# Altium project Eink_Smartwatch.PrjPcb
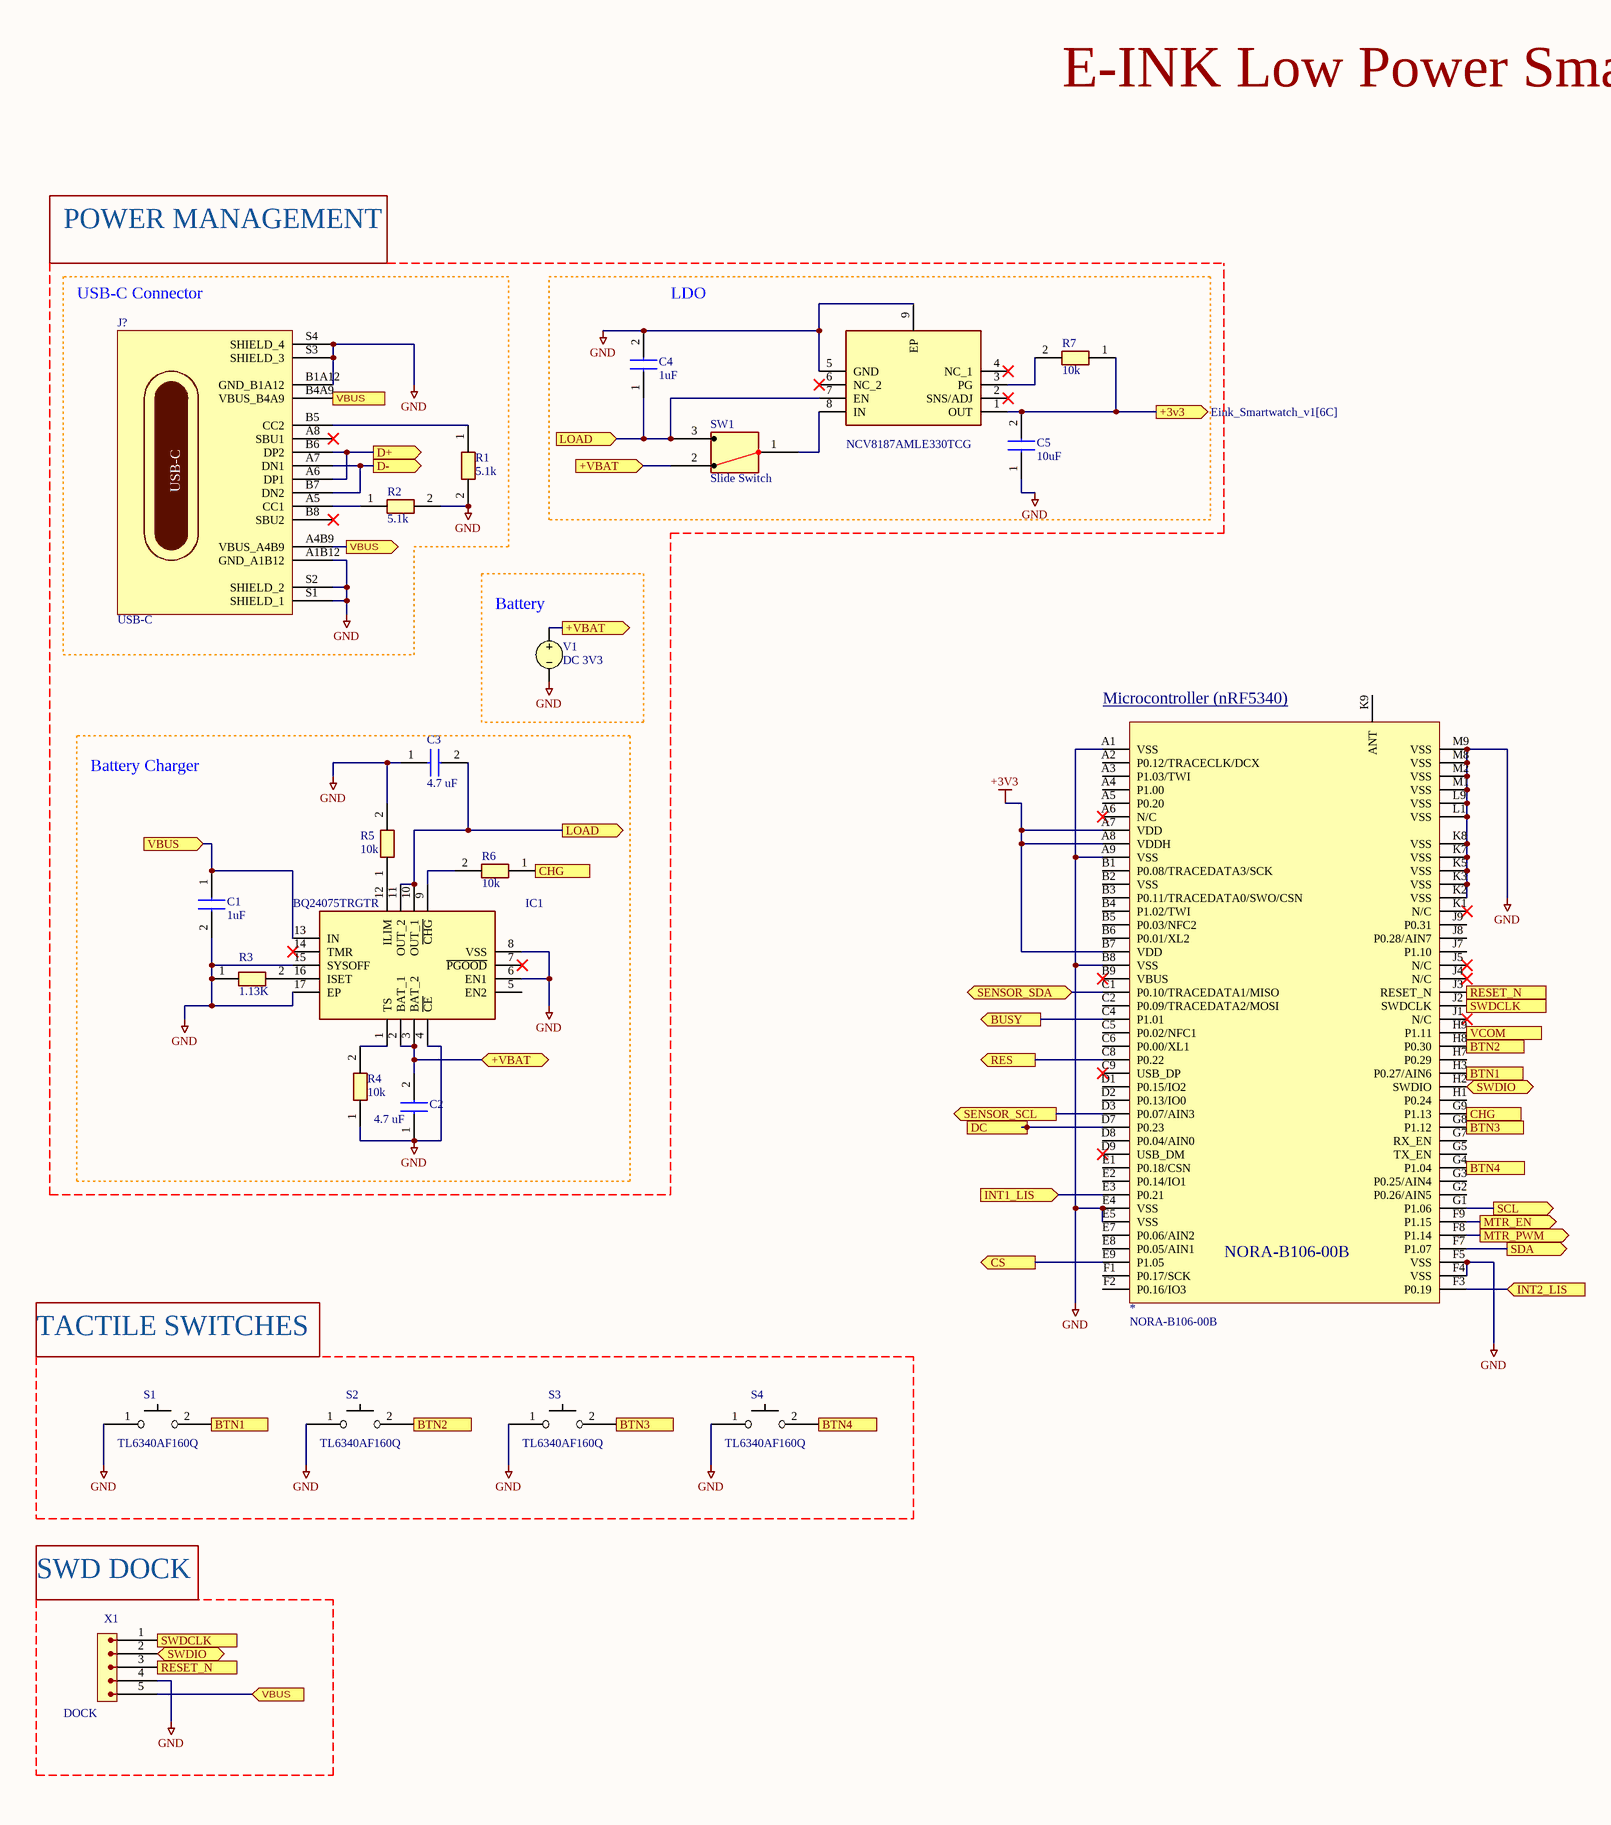
[diagram p0: Eink_Smartwatch_v1.SchDoc, left]
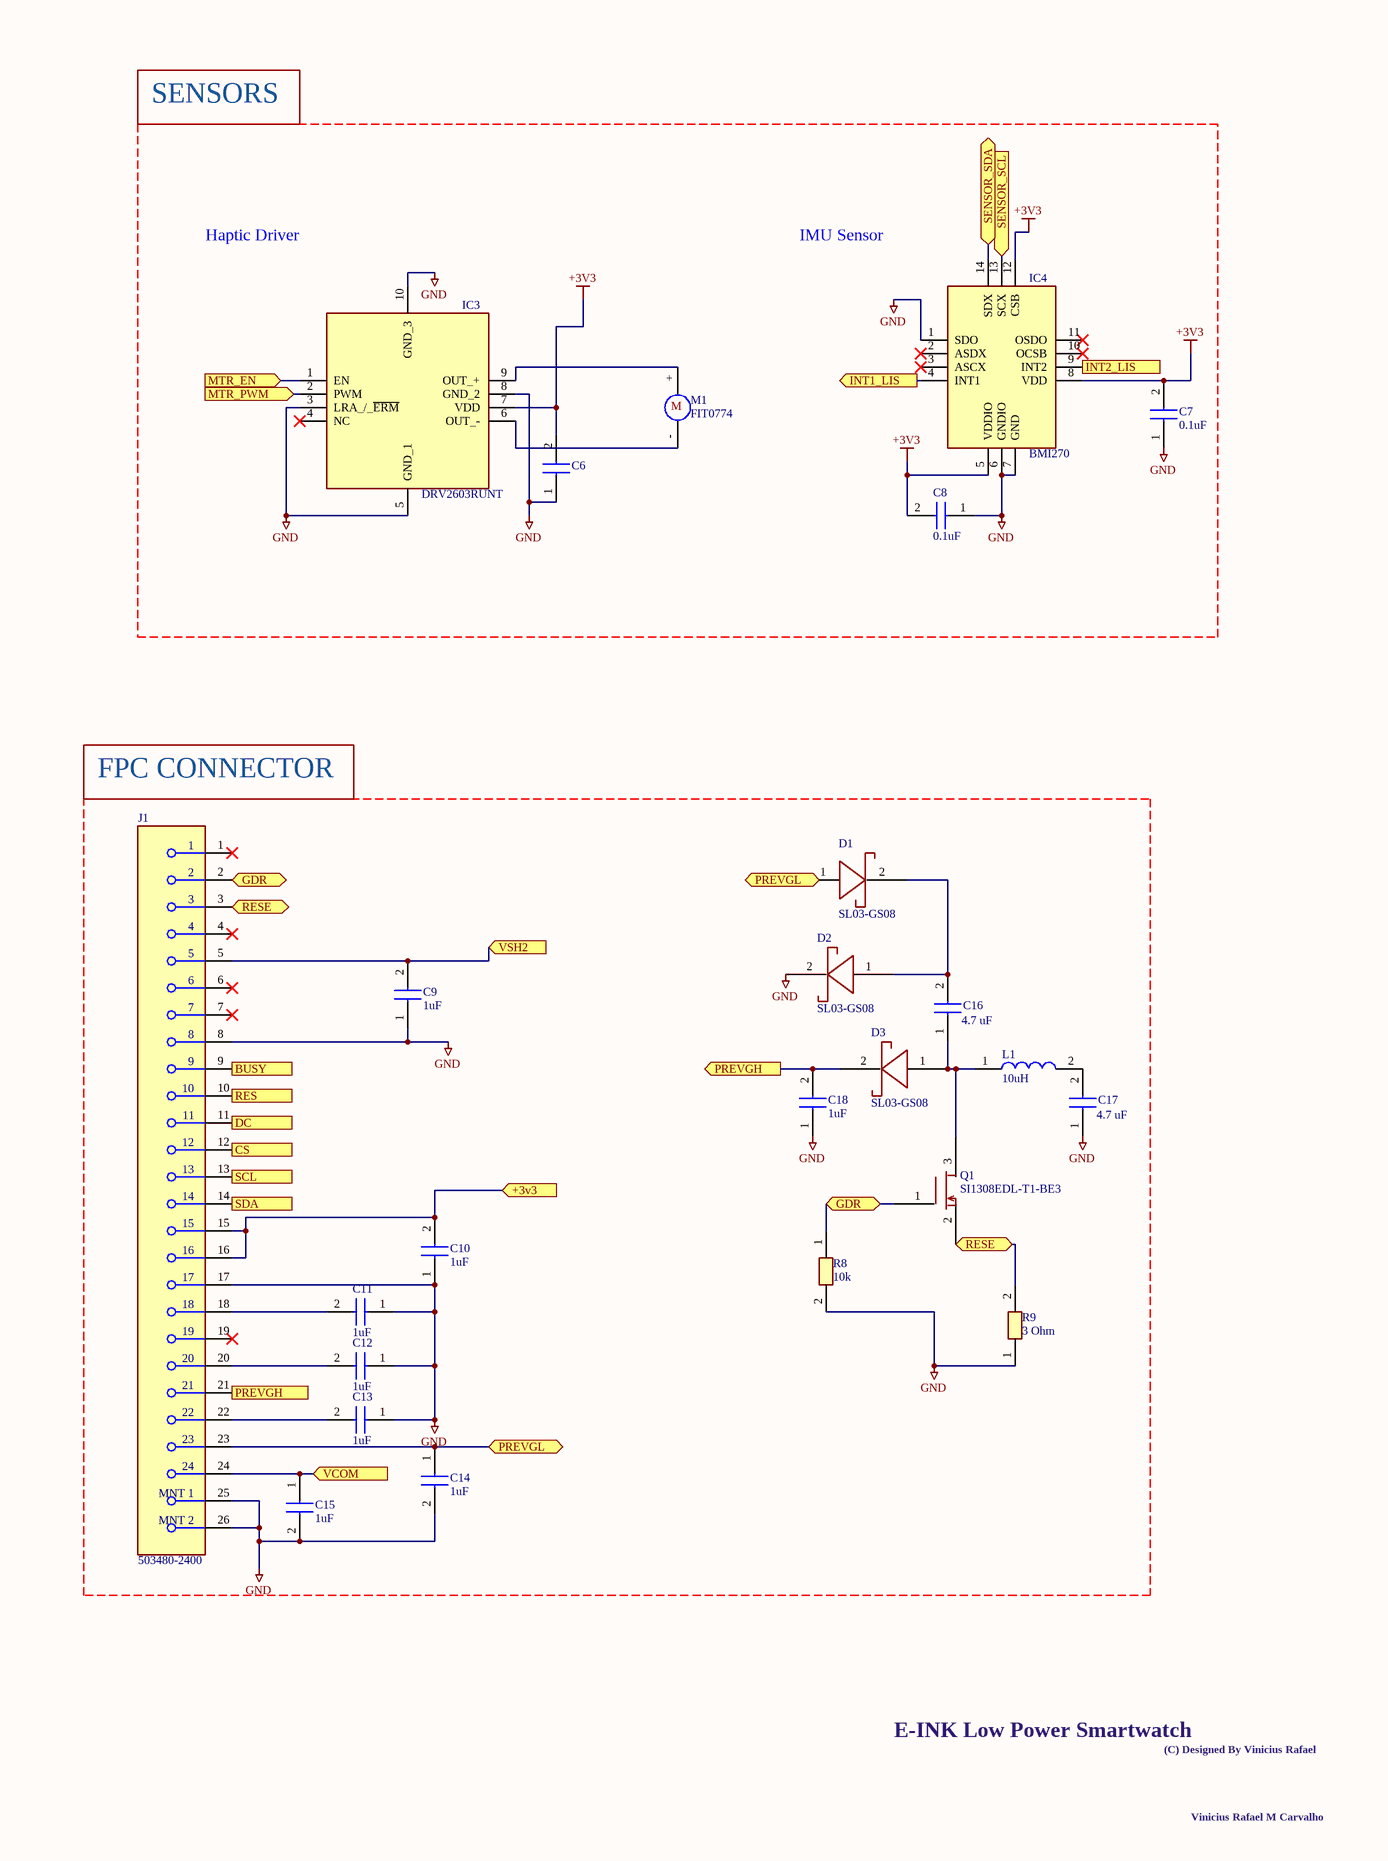
[diagram p1: Eink_Smartwatch_v1.SchDoc, right]
2 sheets, 47 parts. Net scope: flat (ports and power ports of the same name join across sheets).
Board file: Eink_Smartwatch_v1.PcbDoc
Sheets:
  Eink_Smartwatch_v1.SchDoc
  Block_Diagram.SchDoc

## Sheet Eink_Smartwatch_v1.SchDoc
size A2; SheetNumber: 1; SheetTotal: 1

### Parts
*  NORA-B106-00B
C1  1uF
C2  4.7 uF  [GRM31x]
C3  4.7 uF  [GRM31x]
C4  1uF
C5  10uF  [CAPC1608X90N]
C6  0402X7R104KT7AT  [CAPC1005X61N]  (value not drawn)
C7  0.1uF  [CAPC1005X61N]
C8  0.1uF  [CAPC1005X61N]
C9  1uF
C10  1uF
C11  1uF
C12  1uF
C13  1uF
C14  1uF
C15  1uF
C16  4.7 uF  [GRM31x]
C17  4.7 uF  [GRM31x]
C18  1uF
D1  SL03-GS08
D2  SL03-GS08
D3  SL03-GS08
IC1  BQ24075TRGTR  [QFN50P300X300X100-17N-D]
IC2  NCV8187AMLE330TCG  [SON65P300X300X100-9N-D]
IC3  DRV2603RUNT  [QFN50P200X200X80-10N-D]
IC4  BMI270  [BMI270]
J1  503480-2400  [FP-503480-2400-MFG]
J?  USB-C
L1  10uH  [DFE2HCAH1R0MJ0L]
M1  FIT0774
Q1  SI1308EDL-T1-BE3
R1  5.1k
R2  5.1k
R3  1.13K
R4  10k  [RESC1005X37N]
R5  10k  [RESC1005X37N]
R6  10k  [RESC1005X37N]
R7  10k  [RESC1005X37N]
R8  10k  [RESC1005X37N]
R9  3 Ohm
S1  TL6340AF160Q
S2  TL6340AF160Q
S3  TL6340AF160Q
S4  TL6340AF160Q
SW1  Slide Switch
V1  DC 3V3
X1  DOCK

### Blocks framed on the sheet
USB-C Connector: J? R1 R2
LDO: C4 C5 IC2 R7 SW1
SENSORS: C6-C8 IC3 IC4 M1
Battery: V1
Battery Charger: C1-C3 IC1 R3-R6
FPC CONNECTOR: C9-C18 D1-D3 J1 L1 Q1 R8 R9
TACTILE SWITCHES: S1-S4
SWD DOCK: X1

### Ports
+3v3 (in, see Eink_Smartwatch_v1[4A]), +3v3 (out, see Eink_Smartwatch_v1[6C]), +VBAT (bidir, see Eink_Smartwatch_v1[2A], Eink_Smartwatch_v1[2B]), +VBAT (in, see Eink_Smartwatch_v1[2B], Eink_Smartwatch_v1[2C]), +VBAT (out, see Eink_Smartwatch_v1[2A], Eink_Smartwatch_v1[2C]), BTN1 (in, see Eink_Smartwatch_v1[1C]), BTN1 (out, see Eink_Smartwatch_v1[5C]), BTN2 (in, see Eink_Smartwatch_v1[2C]), BTN2 (out, see Eink_Smartwatch_v1[5C]), BTN3 (in, see Eink_Smartwatch_v1[2C]), BTN3 (out, see Eink_Smartwatch_v1[5C]), BTN4 (in, see Eink_Smartwatch_v1[3C]), BTN4 (out, see Eink_Smartwatch_v1[5C]), BUSY (in, see Eink_Smartwatch_v1[3C]), BUSY (out, see Eink_Smartwatch_v1[5C]), CHG (in, see Eink_Smartwatch_v1[2B]), CHG (out, see Eink_Smartwatch_v1[5C]), CS (in, see Eink_Smartwatch_v1[3C]), CS (out, see Eink_Smartwatch_v1[5C]), D+ (out), D- (out), DC  (in, see Eink_Smartwatch_v1[3C]), DC  (out, see Eink_Smartwatch_v1[5C]), GDR (bidir, see Eink_Smartwatch_v1[5C]), GDR (bidir, see Eink_Smartwatch_v1[7C]), INT1_LIS (in, see Eink_Smartwatch_v1[7B]), INT1_LIS (out, see Eink_Smartwatch_v1[3C]), INT2_LIS (in, see Eink_Smartwatch_v1[8B]), INT2_LIS (out, see Eink_Smartwatch_v1[5C]), LOAD (in, see Eink_Smartwatch_v1[2B]), LOAD (out, see Eink_Smartwatch_v1[2A]), MTR_EN (in, see Eink_Smartwatch_v1[5C]), MTR_EN (out, see Eink_Smartwatch_v1[5B]), MTR_PWM (in, see Eink_Smartwatch_v1[5C]), MTR_PWM (out, see Eink_Smartwatch_v1[5B]), PREVGH (in, see Eink_Smartwatch_v1[7C]), PREVGH (out, see Eink_Smartwatch_v1[5D]), PREVGL (bidir, see Eink_Smartwatch_v1[6D]), PREVGL (bidir, see Eink_Smartwatch_v1[7C]), RES (in, see Eink_Smartwatch_v1[3C]), RES (out, see Eink_Smartwatch_v1[5C]), RESE (bidir, see Eink_Smartwatch_v1[5C]), RESE (bidir, see Eink_Smartwatch_v1[7C]), RESET_N (in, see Eink_Smartwatch_v1[1D]), RESET_N (out, see Eink_Smartwatch_v1[5B]), SCL  (in, see Eink_Smartwatch_v1[5C]), SCL  (out, see Eink_Smartwatch_v1[5C]), SDA  (in, see Eink_Smartwatch_v1[5C]), SDA  (out, see Eink_Smartwatch_v1[5C]), SENSOR_SCL (in, see Eink_Smartwatch_v1[3C]), SENSOR_SCL (out, see Eink_Smartwatch_v1[8A]), SENSOR_SDA (bidir, see Eink_Smartwatch_v1[3B]), SENSOR_SDA (bidir, see Eink_Smartwatch_v1[7A]), SWDCLK (in, see Eink_Smartwatch_v1[1D]), SWDCLK (out, see Eink_Smartwatch_v1[5C]), SWDIO (bidir, see Eink_Smartwatch_v1[1D]), SWDIO (bidir, see Eink_Smartwatch_v1[5C]), VBUS (in, see Eink_Smartwatch_v1[1B], Eink_Smartwatch_v1[2A], Eink_Smartwatch_v1[2B]), VBUS (in, see Eink_Smartwatch_v1[1D], Eink_Smartwatch_v1[2A], Eink_Smartwatch_v1[2B]), VBUS (out, see Eink_Smartwatch_v1[1B], Eink_Smartwatch_v1[1D], Eink_Smartwatch_v1[2A]), VBUS (out, see Eink_Smartwatch_v1[1B], Eink_Smartwatch_v1[1D], Eink_Smartwatch_v1[2B]), VCOM (in, see Eink_Smartwatch_v1[5C]), VCOM (out, see Eink_Smartwatch_v1[6D]), VSH2 (in)

### Nets
+3V3: *.A7(VDD) *.A8(VDDH) *.B7(VDD) C6.2 C7.2 C8.2 IC3.7(VDD) IC4.5(VDDIO) IC4.8(VDD) IC4.12(CSB)
GND: *.A1(VSS) *.A9(VSS) *.B8(VSS) *.E4(VSS) *.E5(VSS) *.F4(VSS) *.F5(VSS) *.K2(VSS) *.K3(VSS) *.K5(VSS) *.K7(VSS) *.K8(VSS) *.L1(VSS) *.L9(VSS) *.M1(VSS) *.M2(VSS) *.M8(VSS) *.M9(VSS) C1.2 C2.1 C3.1 C4.2 C5.1 C6.1 C7.1 C8.1 C9.1 C10.1 C11.1 C12.1 C13.1 C14.2 C15.2 C17.1 C18.1 D2.2 IC1.4(~{CE}) IC1.6(EN1) IC1.8(VSS) IC1.15(SYSOFF) IC1.17(EP) IC2.5(GND) IC2.9(EP) IC3.3(LRA_/_~{ERM}) IC3.5(GND_1) IC3.8(GND_2) IC3.10(GND_3) IC4.1(SDO) IC4.6(GNDIO) IC4.7(GND) J1.8 J1.17 J1.25(MNT_1) J1.26(MNT_2) J?.A1B12(GND_A1B12) J?.B1A12(GND_B1A12) J?.S1(SHIELD_1) J?.S2(SHIELD_2) J?.S3(SHIELD_3) J?.S4(SHIELD_4) R1.2 R2.2 R3.1 R4.1 R5.2 R8.2 R9.1 S1.1 S2.1 S3.1 S4.1 V1.2
Net*_C1: *.C1(P0.10/TRACEDATA1/MISO) IC4.14(SDX) ; port SENSOR_SDA
Net*_C4: *.C4(P1.01) J1.9 ; port BUSY
Net*_C8: *.C8(P0.22) J1.10 ; port RES
Net*_D3: *.D3(P0.07/AIN3) IC4.13(SCX) ; port SENSOR_SCL
Net*_D7: *.D7(P0.23) J1.11 ; port DC 
Net*_E3: *.E3(P0.21) IC4.4(INT1) ; port INT1_LIS
Net*_E9: *.E9(P1.05) J1.12 ; port CS
Net*_F3: *.F3(P0.19) IC4.9(INT2) ; port INT2_LIS
Net*_F7: *.F7(P1.07) J1.14 ; port SDA 
Net*_F8: *.F8(P1.14) IC3.2(PWM) ; port MTR_PWM
Net*_F9: *.F9(P1.15) IC3.1(EN) ; port MTR_EN
Net*_G1: *.G1(P1.06) J1.13 ; port SCL 
Net*_G4: *.G4(P1.04) S4.2 ; port BTN4
Net*_G8: *.G8(P1.12) S3.2 ; port BTN3
Net*_G9: *.G9(P1.13) R6.1 ; port CHG
Net*_H2: *.H2(SWDIO) ; port SWDIO
Net*_H3: *.H3(P0.27/AIN6) S1.2 ; port BTN1
Net*_H8: *.H8(P0.30) S2.2 ; port BTN2
Net*_H9: *.H9(P1.11) C15.1 J1.24 ; port VCOM
Net*_J2: *.J2(SWDCLK) ; port SWDCLK
Net*_J3: *.J3(RESET_N) ; port RESET_N
NetC1_1: C1.1 IC1.13(IN) J?.A4B9(VBUS_A4B9) J?.B4A9(VBUS_B4A9) ; port VBUS
NetC2_2: C2.2 IC1.2(BAT_1) IC1.3(BAT_2) SW1.2 V1.1 ; port +VBAT
NetC3_2: C3.2 C4.1 IC1.10(OUT_1) IC1.11(OUT_2) IC2.7(EN) SW1.3 ; port LOAD
NetC5_2: C5.2 C10.2 IC2.1(OUT) J1.15 J1.16 R7.1 ; port +3v3
NetC9_2: C9.2 J1.5 ; port VSH2
NetC11_2: C11.2 J1.18
NetC12_2: C12.2 J1.20
NetC13_2: C13.2 J1.22
NetC14_1: C14.1 J1.23 ; port PREVGL
NetC16_1: C16.1 D3.1 L1.1 Q1.3
NetC16_2: C16.2 D1.2 D2.1
NetC17_2: C17.2 L1.2
NetC18_2: C18.2 D3.2 J1.21 ; port PREVGH
NetIC1_1: IC1.1(TS) R4.2
NetIC1_9: IC1.9(~{CHG}) R6.2
NetIC1_12: IC1.12(ILIM) R5.1
NetIC1_16: IC1.16(ISET) R3.2
NetIC2_3: IC2.3(PG) R7.2
NetIC2_8: IC2.8(IN) SW1.1
NetIC3_6: IC3.6(OUT_-) M1.-
NetIC3_9: IC3.9(OUT_+) M1.+
NetJ1_2: J1.2 Q1.1 R8.1 ; port GDR
NetJ1_3: J1.3 Q1.2 R9.2 ; port RESE
NetJ?_A5: J?.A5(CC1) R2.1
NetJ?_A6: J?.A6(DP1) J?.B6(DP2) ; port D+
NetJ?_A7: J?.A7(DN1) J?.B7(DN2) ; port D-
NetJ?_B5: J?.B5(CC2) R1.1

Not connected (* = marked no-connect by the designer): * A2(P0.12/TRACECLK/DCX) A3(P1.03/TWI) A4(P1.00) A5(P0.20) A6(N/C)* B1(P0.08/TRACEDATA3/SCK) B2(VSS) B3(P0.11/TRACEDATA0/SWO/CSN) B4(P1.02/TWI) B5(P0.03/NFC2) B6(P0.01/XL2) B9(VBUS)* C2(P0.09/TRACEDATA2/MOSI) C5(P0.02/NFC1) C6(P0.00/XL1) C9(USB_DP)* D1(P0.15/IO2) D2(P0.13/IO0) D8(P0.04/AIN0) D9(USB_DM)* E1(P0.18/CSN) E2(P0.14/IO1) E7(P0.06/AIN2) E8(P0.05/AIN1) F1(P0.17/SCK) F2(P0.16/IO3) G2(P0.26/AIN5) G3(P0.25/AIN4) G5(TX_EN) G7(RX_EN) H1(P0.24) H7(P0.29) J1(N/C)* J4(N/C)* J5(N/C)* J7(P1.10) J8(P0.28/AIN7) J9(P0.31) K1(N/C)* K9(ANT); D1 1; IC1 5(EN2) 7(~{PGOOD})* 14(TMR)*; IC2 2(SNS/ADJ)* 4(NC_1)* 6(NC_2)*; IC3 4(NC)*; IC4 2(ASDX)* 3(ASCX)* 10(OCSB)* 11(OSDO)*; J1 1* 4* 6* 7* 19*; J? A8(SBU1)* B8(SBU2)*; X1 1 2 3 4 5

### Notes on the sheet
- E-INK Low Power Smartwatch
- POWER MANAGEMENT
- Haptic Driver
- IMU Sensor
- (near *) Microcontroller (nRF5340) <https://br.mouser.com/datasheet/2/1025/NORA_B1_DataSheet_UBX_20027119-3180474.pdf>
- (C) Designed By Vinicius Rafael
- Vinicius Rafael M Carvalho
- (in symbol FIT0774) M
- (in symbol CMP-00257-81652754-1) NC; GDR; RESE; VSH2; TSCL; TSDA; BS; BUSY; RES; DC; CS; SCL; SDA; VDDIO; VCI; VSS; VDD; VPP; VSH1; PREVGH; VSL; PREVGL; VCOM

### Library data of the parts
* = NORA-B106-00B: Bluetooth Modules - 802.15.1 nRF5340, PCB antenna, open CPU; Manufacturer: u-blox; Supplier: Mouser; Supplier Part Number: 377-NORA-B106-00B; Manufacturer Part Number: NORA-B106-00B; RoHS: No; Category: LDO; Stock: 4440; Pricing: 1=14, 10=12,74, 50=11,72, 100=10,9, 1000=10,9, 10000=10,9 (USD); ComponentLink1URL: https://datasheet.octopart.com/NORA-B106-00B-u-blox-datasheet-166811452.pdf?src-supplier=TME; ComponentLink1Description: https://datasheet.octopart.com/NORA-B106-00B-u-blox-datasheet-166811452.pdf?src-supplier=TME
C1 C4 C9-C15 C18 = GCM188D71H105KE36J: Capacitores de cerâmica multicamada MLCC - SMD/SMT 0603 50VDC X7T 1uF 10% AEC-Q200; Manufacturer: Murata; Supplier: Mouser; Supplier Part Number: 81-GCM188D71H105KE6J; Manufacturer Part Number: GCM188D71H105KE36J; RoHS: No; Category: Ceramic Capacitors; Stock: 8350; Pricing: 1=0,25, 10=0,101, 50=0,101, 100=0,059, 1000=0,051, 10000=0,039 (USD)
C2 C3 C16 C17 = GRM31CZ72A475KE11K: Capacitores de cerâmica multicamada MLCC - SMD/SMT 4.7 uF 100 VDC 10% 1206 X7R; Manufacturer_Name: Murata Electronics; Datasheet Link: https://search.murata.co.jp/Ceramy/image/img/A01X/G101/ENG/GRM31CZ72A475KE11-01A.pdf; Height: 1.15mm; Manufacturer_Part_Number: GRM31CZ72A475KE11K; Mouser Part Number: 81-GRM31CZ72A475K11K; Mouser Price/Stock: https://www.mouser.co.uk/ProductDetail/Murata-Electronics/GRM31CZ72A475KE11K?qs=d0WKAl%252BL4KZ8%252BL6wtNbppg%3D%3D
C5 = LMK107BJ106MALTD: Capacitores de cerâmica multicamada MLCC - SMD/SMT 10V 10uF X5R 0603 20 %; Manufacturer_Name: TAIYO YUDEN; Datasheet Link: https://ds.yuden.co.jp/TYCOMPAS/ut/download?pn=LMK063BBJ474MPLF&fileType=CA; Height: 0.9mm; Manufacturer_Part_Number: LMK107BJ106MALTD; Mouser Part Number: 963-LMK107BJ106MALTD; Mouser Price/Stock: https://www.mouser.co.uk/ProductDetail/TAIYO-YUDEN/LMK107BJ106MALTD?qs=PzICbMaShUde1djJr8Be9g%3D%3D; Arrow Part Number: LMK107BJ106MALTD; Arrow Price/Stock: https://www.arrow.com/en/products/lmk107bj106maltd/taiyo-yuden
C6-C8 = 0402X7R104KT7AT: Multilayer Ceramic Capacitors MLCC - SMD/SMT 16V 0.1uF X7R 10%; Manufacturer_Name: Kyocera AVX; Datasheet Link: https://www.mouser.es/datasheet/2/40/general_purpose-3169586.pdf; Height: 0.61mm; Manufacturer_Part_Number: 0402X7R104KT7AT; Mouser Part Number: 581-0402X7R104KT7AT; Mouser Price/Stock: https://www.mouser.co.uk/ProductDetail/KYOCERA-AVX/0402X7R104KT7AT?qs=DPoM0jnrROXD467pFR2ukA%3D%3D
D1-D3 = SL03-GS08: Rectifier Diode, Schottky, 1 Phase, 1 Element, 1.1A, 30V V(RRM), Silicon, DO-219AB; Manufacturer: Vishay Semiconductors; Package Body Material: Plastic; Application(s): EFFICIENCY; Forward Voltage: 430mV; Non-rep Pk Forward Current-Max: 40A; Number of Elements: 1; Qualification Status: Not Qualified; Supplier: Mouser; Supplier Part Number: 625-SL03; Manufacturer Part Number: SL03-GS08; RoHS: Yes; Category: Rectifier Diodes; Stock: 88607; Pricing: 1=0,41, 10=0,274, 50=0,339, 100=0,185, 500=0,144, 1000=0,13, 3000=0,099, 9000=0,089, 10000=0,092, 24000=0,087 (USD); Pins: 2; Diode Element Material: SILICON; Package Shape: Rectangular; Terminal Finish: Tin; Max Operating Temperature: 125°C; JESD-609 Code: e3; Diode Type: RECTIFIER; JESD-30 Code: R-PDSO-F2; Moisture Sensitivity Level: 1; Number of Phases: 1; Max Output current: 1.1A; Package Style: SMALL OUTLINEMeter; Rep Pk Reverse Voltage-Max: 30V; Surface Mount: Yes; Technology: SCHOTTKY; Terminal Form: Flat; Terminal Position: DUAL; JEDEC-95 Code: DO-219AB; RoHS Compliant: Yes; Reach SVHC Compliant: No; ComponentLink1URL: https://datasheet.ciiva.com:443/pdfs/VipMasterIC/IC/VISH/VISH-S-A0009169378/VISH-S-A0009169378-1.pdf?src-supplier=IHS+Markit; ComponentLink1Description: https://datasheet.ciiva.com:443/pdfs/VipMasterIC/IC/VISH/VISH-S-A0009169378/VISH-S-A0009169378-1.pdf?src-supplier=IHS+Markit; ComponentLink2URL: https://datasheet.ciiva.com/910/sl02-03-04-910861.pdf?src-supplier=Digikey; ComponentLink2Description: https://datasheet.ciiva.com/910/sl02-03-04-910861.pdf?src-supplier=Digikey; ComponentLink3URL: https://datasheet.ciiva.com/910/sl02-910862.pdf?src-supplier=Digikey; ComponentLink3Description: https://datasheet.ciiva.com/910/sl02-910862.pdf?src-supplier=Digikey; ComponentLink4URL: https://datasheet.ciiva.com/910/sl02-910863.pdf?src-supplier=Digikey; ComponentLink4Description: https://datasheet.ciiva.com/910/sl02-910863.pdf?src-supplier=Digikey; ComponentLink5URL: https://datasheet.ciiva.com/8290/sl02-8290522.pdf?src-supplier=Avnet; ComponentLink5Description: https://datasheet.ciiva.com/8290/sl02-8290522.pdf?src-supplier=Avnet; ComponentLink6URL: https://datasheet.ciiva.com/16486/sl02-16486940.pdf?src-supplier=Future+Electronics; ComponentLink6Description: https://datasheet.ciiva.com/16486/sl02-16486940.pdf?src-supplier=Future+Electronics
IC1 = BQ24075TRGTR: Gerenciadores de bateria 1.5A USB-Friendly Li Ion Batt Charger; Manufacturer_Name: Texas Instruments; Datasheet Link: http://componentsearchengine.com/Datasheets/1/BQ24075TRGTR.pdf; Height: 1mm; Manufacturer_Part_Number: BQ24075TRGTR; Mouser Part Number: 595-BQ24075TRGTR; Mouser Price/Stock: https://www.mouser.co.uk/ProductDetail/Texas-Instruments/BQ24075TRGTR?qs=%2Fqzd9s%252BcLd4uxZAT5jNskQ%3D%3D; Arrow Part Number: BQ24075TRGTR; Arrow Price/Stock: https://www.arrow.com/en/products/bq24075trgtr/texas-instruments?region=nac
IC2 = NCV8187AMLE330TCG: LDO Voltage Regulators 1.2A LDO Regulator, Low Dropout Voltage, Low Noise with Power Good Output flipped die, 3V3, active discharge; Manufacturer_Name: onsemi; Datasheet Link: https://www.onsemi.com/pdf/datasheet/ncv8187-d.pdf; Height: 1mm; Manufacturer_Part_Number: NCV8187AMLE330TCG; Mouser Part Number: 863-CV8187AMLE330TCG; Mouser Price/Stock: https://www.mouser.co.uk/ProductDetail/onsemi/NCV8187AMLE330TCG?qs=HBWAp0VN4RhK8HbhfCLXcQ%3D%3D; Arrow Part Number: NCV8187AMLE330TCG; Arrow Price/Stock: https://www.arrow.com/en/products/ncv8187amle330tcg/on-semiconductor?region=nac
IC3 = DRV2603RUNT: Motor / Motion / Ignition Controllers & Drivers Haptic Driver w/Auto Resonance Tracking; Manufacturer_Name: Texas Instruments; Datasheet Link: http://www.ti.com/lit/ds/symlink/drv2603.pdf; Height: 0.8mm; Manufacturer_Part_Number: DRV2603RUNT; Mouser Part Number: 595-DRV2603RUNT; Mouser Price/Stock: https://www.mouser.co.uk/ProductDetail/Texas-Instruments/DRV2603RUNT?qs=y0LsnOHuQQ66fXxKAgGo4A%3D%3D; Arrow Part Number: DRV2603RUNT; Arrow Price/Stock: https://www.arrow.com/en/products/drv2603runt/texas-instruments
IC4 = BMI270: IMUs - Inertial Measurement Units Smart Ultra-Low Power Inertial Measurement Unit (IMU) for Wearable Applications; Manufacturer_Name: BOSCH; Datasheet Link: https://www.bosch-sensortec.com/media/boschsensortec/downloads/datasheets/bst-bmi270-ds000.pdf; Height: 0.87mm; Manufacturer_Part_Number: BMI270; Mouser Part Number: 262-BMI270; Mouser Price/Stock: https://www.mouser.co.uk/ProductDetail/Bosch-Sensortec/BMI270?qs=u16ybLDytRYIj%252BjQEee88A%3D%3D; Arrow Part Number: BMI270; Arrow Price/Stock: https://www.arrow.com/en/products/bmi270/bosch?utm_currency=USD&region=nac
J1 = CMP-00257-81652754-1: 503480-2400 Molex 503480-2400 FFC & FPC Connectors, 0.5mm, FPC Ra Smt Dual Cont 24 Circuit,; Manufacturer Lifecycle Status: ACTIVE; Number of Contacts: 24; Voltage Rating: 50V; Plating: Gold; Current Rating: 500mA; Contact Plating: Gold; Mount: Surface Mount; Country of Origin: KR; Number of Rows: 1; Orientation: Right Angle; Lifecycle Status: Production; RoHS: Compliant; Min Operating Temperature: -40°C; Contact Material: Gold, Nickel; Max Operating Temperature: 85°C; Height: 2.07mm; Number of Circuits: 24; NexarPartId: 81652754
J? = 217179-0001: USB Connector, 16 Contact(s), Female, Right Angle, Surface Mount Terminal, Locking, Receptacle; Manufacturer: Molex; Supplier: Mouser; Supplier Part Number: 538-217179-0001; Manufacturer Part Number: 217179-0001; RoHS: No; Category: USB Connectors; Stock: 4841; Pricing: 1=0,9, 10=0,745, 50=0,745, 100=0,622, 1000=0,622, 10000=0,446 (USD)
L1 = 1239AS-H-100M=P2: Indutores de potência - SMD 10 UH 20%; Manufacturer_Name: Murata Electronics; Datasheet Link: https://psearch.en.murata.com/inductor/product/1239AS-H-100M%23.html; Height: 1.2mm; Manufacturer_Part_Number: 1239AS-H-100M=P2; Mouser Part Number: 81-1239AS-H-100MP2; Mouser Price/Stock: https://www.mouser.co.uk/ProductDetail/Murata-Electronics/1239AS-H-100M%3dP2?qs=KuGPmAKtFKWZyoO25uKvSg%3D%3D; Arrow Part Number: 1239AS-H-100M=P2; Arrow Price/Stock: https://www.arrow.com/en/products/1239as-h-100mp2/murata-manufacturing?region=nac
M1 = FIT0774: Mini Vibration Motor (10*2.7MM); Manufacturer: DFRobot; Supplier: Mouser; Supplier Part Number: 426-FIT0774; Manufacturer Part Number: FIT0774; RoHS: No; Category: Motors and Drives; Stock: 3316; Pricing: 1=0,99, 10=0,99, 50=0,99, 100=0,99, 1000=0,99, 10000=0,99 (USD)
Q1 = SI1308EDL-T1-BE3: Transistor MOSFET N-Channel 30V 1.4A 3-Pin SOT-323; Manufacturer: Vishay; Supplier: Mouser; Supplier Part Number: 78-SI1308EDL-T1-BE3; Manufacturer Part Number: SI1308EDL-T1-BE3; RoHS: No; Stock: 79433; Pricing: 1=0,4, 10=0,276, 50=0,276, 100=0,172, 1000=0,129, 10000=0,098 (USD); ComponentLink1URL: https://datasheet.octopart.com/SI1308EDL-T1-BE3-Vishay-datasheet-151651462.pdf?src-supplier=Future+Electronics; ComponentLink1Description: https://datasheet.octopart.com/SI1308EDL-T1-BE3-Vishay-datasheet-151651462.pdf?src-supplier=Future+Electronics
R1 R2 = ERJ-2RHD512X: Fixed Resistor, Metal Glaze/thick Film, 0.063W, 5110ohm, 50V, 0.5% +/-Tol, 50ppm/Cel, Surface Mount, 0402; Manufacturer: Panasonic; Manufacturer Series: ERJ2R; Power: 63mW; Rated Temperature: 70°C; Value: 5.11kR; Temperature Coefficient: 50ppm/°C; Supplier: Mouser; Supplier Part Number: 667-ERJ-2RHD512X; Manufacturer Part Number: ERJ-2RHD512X; RoHS: Yes; Stock: 18329; Pricing: 1=0,13, 10=0,11, 50=0,11, 100=0,043, 1000=0,019, 10000=0,019 (USD); Mounting Technology: Surface Mount; Pins: 2; Package Shape: Rectangular; Case/Package: 0402; Terminal Finish: Tin; Min Operating Temperature: -55°C; Max Operating Temperature: 125°C; Tolerance: 0.5%; JESD-609 Code: e3; Resistor Type: FIXED RESISTOR; Packaging: Tape and Reel; Technology: METAL GLAZE/THICK FILM; Termination: Wraparound; Working Voltage: 50V; Reach SVHC Compliant: Yes; RoHS Compliant: Yes; ComponentLink1URL: https://datasheet.ciiva.com:443/pdfs/VipMasterCap/Capacitor/PANA/PANAS11022/PANAS11022-1.pdf?src-supplier=IHS+Markit; ComponentLink1Description: https://datasheet.ciiva.com:443/pdfs/VipMasterCap/Capacitor/PANA/PANAS11022/PANAS11022-1.pdf?src-supplier=IHS+Markit; ComponentLink2URL: https://datasheet.ciiva.com/24037/aoa0000ce2-24037669.pdf?src-supplier=Mouser; ComponentLink2Description: https://datasheet.ciiva.com/24037/aoa0000ce2-24037669.pdf?src-supplier=Mouser
R3 = AF0402FR-071K13L: Fixed Resistor, Metal Glaze/thick Film, 0.0625W, 1130ohm, 50V, 1% +/-Tol, 100ppm/Cel, Surface Mount, 0402; Manufacturer: Yageo; Additional Feature: ANTI-SULFUR; Power: 62.5mW; Rated Temperature: 70°C; Value: 1.13kR; Temperature Coefficient: 100ppm/°C; Package Height: 0.32mm; Package Length: 1mm; Package Width: 0.5mm; Reference Standard: AEC-Q200; Supplier: Mouser; Supplier Part Number: 603-AF0402FR-071K13L; Manufacturer Part Number: AF0402FR-071K13L; RoHS: Yes; Category: Chip SMD Resistors; Stock: 3100; Pricing: 1=0,15, 10=0,037, 50=0,037, 100=0,02, 1000=0,012, 10000=0,006 (USD); Mounting Technology: Surface Mount; Pins: 2; Case/Package: 0402; Min Operating Temperature: -55°C; Max Operating Temperature: 155°C; Tolerance: 1%; Resistor Type: FIXED RESISTOR; Construction: Rectangular; Package Style: SMTMeter; Packaging: Tape and Reel; Termination: Wraparound; Working Voltage: 50V; Reach SVHC Compliant: Yes; RoHS Compliant: Yes; ComponentLink1URL: https://datasheet.ciiva.com:443/pdfs/VipMasterIC/IC/YAGO/YAGO-S-A0009016998/YAGO-S-A0009016998-1.pdf?src-supplier=IHS+Markit; ComponentLink1Description: https://datasheet.ciiva.com:443/pdfs/VipMasterIC/IC/YAGO/YAGO-S-A0009016998/YAGO-S-A0009016998-1.pdf?src-supplier=IHS+Markit; ComponentLink2URL: https://www.yageo.com/upload/media/product/productsearch/datasheet/rchip/PYu-AF_51_RoHS_L_6.pdf?src-supplier=Digikey; ComponentLink2Description: https://www.yageo.com/upload/media/product/productsearch/datasheet/rchip/PYu-AF_51_RoHS_L_6.pdf?src-supplier=Digikey
R4-R8 = MCS0402MD1002BE100: Resistores de Filme Fino - SMD .063W 10Kohms 0.1% 0402 25ppm Auto; Manufacturer_Name: Vishay; Datasheet Link: http://www.vishay.com/docs/28705/mcx0x0xpro.pdf; Height: 0.37mm; Manufacturer_Part_Number: MCS0402MD1002BE100; Mouser Part Number: 594-MCS0402MD1002BE1; Mouser Price/Stock: https://www.mouser.co.uk/ProductDetail/Vishay-Beyschlag/MCS0402MD1002BE100?qs=3SvaY9RawMIFge2HspqWnA%3D%3D; Arrow Part Number: MCS0402MD1002BE100; Arrow Price/Stock: https://www.arrow.com/en/products/mcs0402md1002be100/vishay?region=nac
R9 = CRCW06033R00JNTA: Fixed Resistor, Metal Glaze/thick Film, 0.1W, 3ohm, 75V, 5% +/-Tol, 200ppm/Cel, Surface Mount, 0603; Manufacturer: Vishay Dale; Manufacturer Series: CRCW; Power: 100mW; Rated Temperature: 70°C; Value: 3R; Temperature Coefficient: 200ppm/°C; Package Height: 0.45mm; Package Length: 1.55mm; Package Width: 0.85mm; Reference Standard: AEC-Q200; Supplier: Mouser; Supplier Part Number: 71-CRCW0603J-3; Manufacturer Part Number: CRCW06033R00JNTA; RoHS: No; Category: Chip SMD Resistors; Stock: 24685; Pricing: 1=0,16, 10=0,111, 50=0,111, 100=0,042, 1000=0,018, 10000=0,013 (USD); Mounting Technology: Surface Mount; Pins: 2; Package Shape: Rectangular; Case/Package: 0603; Terminal Finish: Nickel; Min Operating Temperature: -55°C; Max Operating Temperature: 155°C; Tolerance: 5%; JESD-609 Code: e0; Resistor Type: FIXED RESISTOR; Construction: Chip; Package Style: SMTMeter; Packaging: Tape and Reel; Series: D/CRCW; Technology: METAL GLAZE/THICK FILM; Termination: Wraparound; Working Voltage: 75V; RoHS Compliant: No; Reach SVHC Compliant: No; ComponentLink1URL: https://datasheet.ciiva.com:443/pdfs/VipMasterIC/IC/VISH/VISH-S-A0002183699/VISH-S-A0002183699-1.pdf?src-supplier=IHS+Markit; ComponentLink1Description: https://datasheet.ciiva.com:443/pdfs/VipMasterIC/IC/VISH/VISH-S-A0002183699/VISH-S-A0002183699-1.pdf?src-supplier=IHS+Markit; ComponentLink2URL: https://datasheet.ciiva.com/2563/dcrcw-2563882.pdf?src-supplier=Digikey; ComponentLink2Description: https://datasheet.ciiva.com/2563/dcrcw-2563882.pdf?src-supplier=Digikey; ComponentLink3URL: https://datasheet.ciiva.com/9082/dcrcw-9082586.pdf?src-supplier=Avnet; ComponentLink3Description: https://datasheet.ciiva.com/9082/dcrcw-9082586.pdf?src-supplier=Avnet
S1-S4 = TL6340AF160Q: Keypad Switch, 1 Switches, SPST, Momentary-tactile, 0.02A, 12VDC, 1.57N, 2 PCB Hole Cnt, Solder Terminal, Surface Mount-right Angle; Manufacturer: E-Switch; Supplier: Mouser; Supplier Part Number: 612-TL6340AF160QG; Manufacturer Part Number: TL6340AF160Q; RoHS: Yes; Category: Tactile Switches; Stock: 2006; Pricing: 1=0,51, 10=0,478, 50=0,478, 100=0,377, 1000=0,313, 10000=0,255 (USD); ComponentLink1URL: https://datasheet.octopart.com/TL6340AF160Q-E-Switch-datasheet-155697155.pdf?src-supplier=Future+Electronics; ComponentLink1Description: https://datasheet.octopart.com/TL6340AF160Q-E-Switch-datasheet-155697155.pdf?src-supplier=Future+Electronics; ComponentLink2URL: https://datasheet.octopart.com/TL6340AF160Q-E-Switch-datasheet-165860010.pdf?src-supplier=TME; ComponentLink2Description: https://datasheet.octopart.com/TL6340AF160Q-E-Switch-datasheet-165860010.pdf?src-supplier=TME
SW1 = SLW-835636-3A-RA-N-D: 8.3 X 5.6 X 3.6 Mm, 3 Mm Raised; Manufacturer: CUI Devices; Supplier: Mouser; Supplier Part Number: 179-SLW8356363ARAND; Manufacturer Part Number: SLW-835636-3A-RA-N-D; RoHS: No; Category: LDO; Stock: 1000; Pricing: 1=0,41, 10=0,409, 50=0,409, 100=0,335, 1000=0,254, 10000=0,216 (USD)
V1 = VSRC: Voltage Source; Note: PCB Footprint - Not required; AC Magnitude: 1; AC Phase: 0; Published: 8-Jun-2000; LatestRevisionDate: 17-Jul-2002; LatestRevisionNote: Re-released for DXP Platform.; PackageReference: Not Applicable; Publisher: Altium Limited; Value: 3V3
X1 = 4048: Mini SWD 0.05 Pitch Connector - 10 Pin SMT Box Header | Adafruit Industries 4048; Supplier: Mouser; Supplier Part Number: 485-4048; Manufacturer: Adafruit Industries; Manufacturer Part Number: 4048; RoHS: No; Category: Connectors; Stock: 723; Pricing: 1=1,95, 10=1,95, 50=1,95, 100=1,95, 1000=1,95, 10000=1,95 (USD); ComponentLink1URL: https://media.digikey.com/pdf/Data%20Sheets/Adafruit%20PDFs/4048_Web.pdf?src-supplier=Digikey; ComponentLink1Description: https://media.digikey.com/pdf/Data%20Sheets/Adafruit%20PDFs/4048_Web.pdf?src-supplier=Digikey

## Sheet Block_Diagram.SchDoc
size A4; SheetNumber: 2; SheetTotal: 2
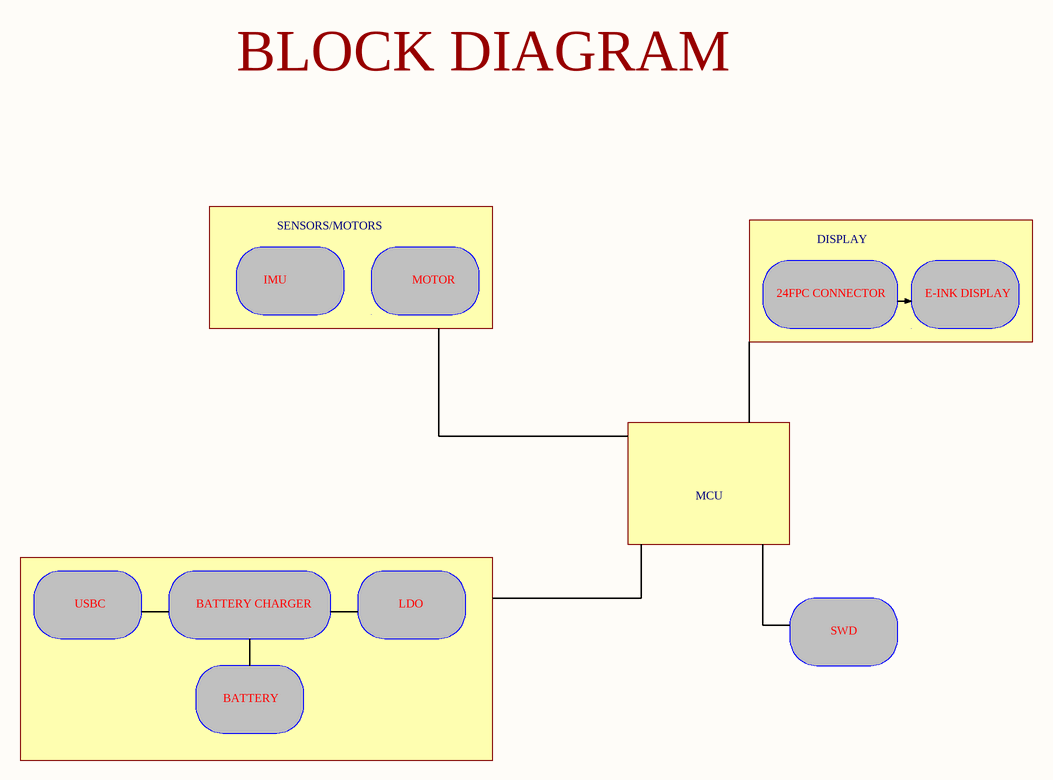
[diagram p2: Block_Diagram.SchDoc]

### Notes on the sheet
- BLOCK DIAGRAM
- SENSORS/MOTORS
- DISPLAY
- IMU
- MOTOR
- 24FPC CONNECTOR
- E-INK DISPLAY
- MCU
- USBC
- BATTERY CHARGER
- LDO
- SWD
- BATTERY